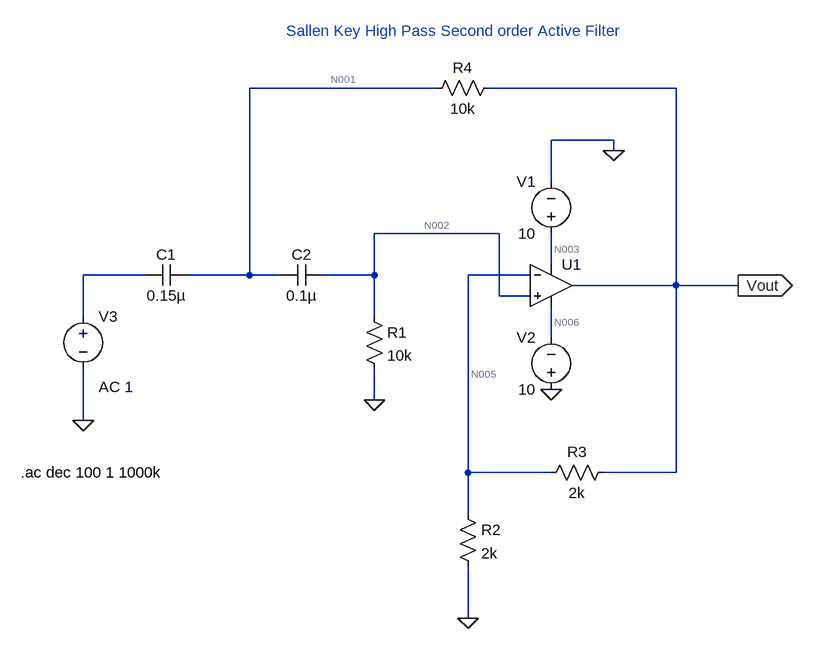
[diagram p0: schematic Second Order High Pass Active Filter.asc]
Second Order High Pass Active Filter.asc, the LTspice schematic file:
Version 4
SHEET 1 880 708
WIRE 96 -128 -192 -128
WIRE 464 -128 176 -128
WIRE 368 -48 272 -48
WIRE 368 -32 368 -48
WIRE 272 16 272 -48
WIRE 192 96 0 96
WIRE 272 144 272 96
WIRE -352 160 -448 160
WIRE -192 160 -192 -128
WIRE -192 160 -288 160
WIRE -144 160 -192 160
WIRE 0 160 0 96
WIRE 0 160 -80 160
WIRE 240 160 144 160
WIRE 464 176 464 -128
WIRE 464 176 304 176
WIRE 560 176 464 176
WIRE 192 192 192 96
WIRE 240 192 192 192
WIRE -448 224 -448 160
WIRE 0 224 0 160
WIRE 272 256 272 208
WIRE 0 352 0 304
WIRE -448 384 -448 304
WIRE 144 464 144 160
WIRE 272 464 144 464
WIRE 464 464 464 176
WIRE 464 464 352 464
WIRE 144 528 144 464
WIRE 144 688 144 608
FLAG 0 352 0
FLAG -448 384 0
FLAG 144 688 0
FLAG 272 336 0
FLAG 368 -32 0
FLAG 560 176 Vout
IOPIN 560 176 Out
SYMBOL Opamps\\UniversalOpamp2 272 176 R0
SYMATTR InstName U1
SYMBOL voltage 272 112 R180
WINDOW 0 24 96 Left 2
WINDOW 3 24 16 Left 2
WINDOW 123 0 0 Left 0
WINDOW 39 0 0 Left 0
SYMATTR InstName V1
SYMATTR Value 10
SYMBOL voltage 272 352 R180
WINDOW 0 24 96 Left 2
WINDOW 3 24 16 Left 2
WINDOW 123 0 0 Left 0
WINDOW 39 0 0 Left 0
SYMATTR InstName V2
SYMATTR Value 10
SYMBOL cap -288 144 R90
WINDOW 0 0 32 VBottom 2
WINDOW 3 32 32 VTop 2
SYMATTR InstName C1
SYMATTR Value 0.15µ
SYMBOL cap -80 144 R90
WINDOW 0 0 32 VBottom 2
WINDOW 3 32 32 VTop 2
SYMATTR InstName C2
SYMATTR Value 0.1µ
SYMBOL res -16 208 R0
SYMATTR InstName R1
SYMATTR Value 10k
SYMBOL res 128 512 R0
SYMATTR InstName R2
SYMATTR Value 2k
SYMBOL res 368 448 R90
WINDOW 0 0 56 VBottom 2
WINDOW 3 32 56 VTop 2
SYMATTR InstName R3
SYMATTR Value 2k
SYMBOL res 192 -144 R90
WINDOW 0 0 56 VBottom 2
WINDOW 3 32 56 VTop 2
SYMATTR InstName R4
SYMATTR Value 10k
SYMBOL voltage -448 208 R0
WINDOW 123 24 124 Left 2
WINDOW 39 0 0 Left 0
SYMATTR Value2 AC 1
SYMATTR InstName V3
SYMATTR Value ""
TEXT -136 -216 Left 2 ;Sallen Key High Pass Second order Active Filter
TEXT -544 464 Left 2 !.ac dec 100 1 1000k

The netlist it stands for:
* Second Order High Pass Active Filter.asc
XU1 N002 N005 N003 N006 Vout level.2 Avol=1Meg GBW=10Meg Slew=10Meg ilimit=25m rail=0 Vos=0 phimargin=45 en=0 enk=0 in=0 ink=0 Rin=500Meg  ; pins IN+ IN- V+ V- OUT
V1 N003 0 10
V2 0 N006 10
C1 N001 N004 0.15µ
C2 N002 N001 0.1µ
R1 N002 0 10k
R2 N005 0 2k
R3 Vout N005 2k
R4 Vout N001 10k
V3 N004 0 AC 1
* Sallen Key High Pass Second order Active Filter
.ac dec 100 1 1000k
.lib UniversalOpamps2.sub
.backanno
.end

* Results of the author's LTspice run, read from the files saved beside the schematic
* Operating Point, zero values left out:
*   V(n003) = 10 V
*   V(n006) = -10 V
*   I(V2) = -999.5 µA
*   I(V1) = -999.5 µA
*   Ix(u1:3) = 999.5 µA
*   Ix(u1:4) = -999.5 µA
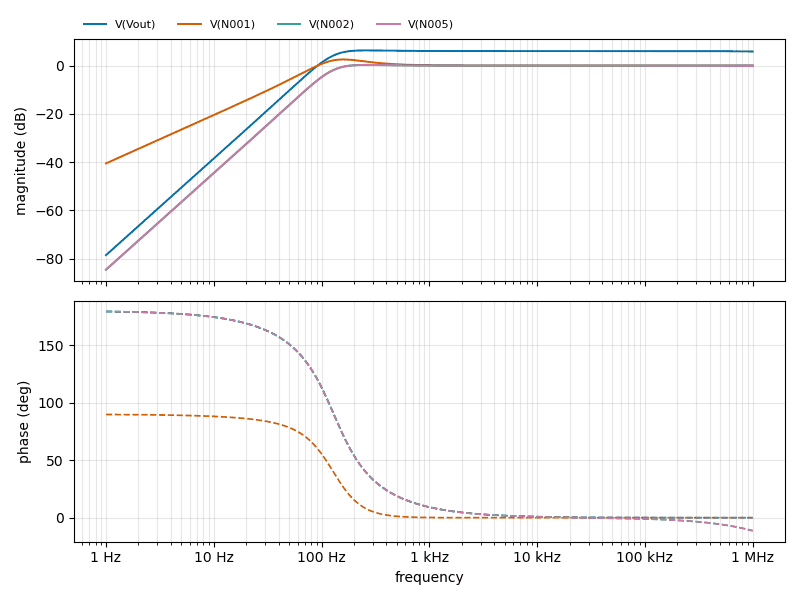
[diagram p1: AC Analysis of Second Order High Pass Active Filter.asc, plotted from the saved traces]
* AC Analysis, 1 run:
*   V(Vout): -78.53 dB at 1 Hz, 5.85 dB at 1 MHz, peak 6.30 dB at 257 Hz, 3 dB below the peak at 117.7 Hz
*   V(N001): -40.51 dB at 1 Hz, -0.00 dB at 1 MHz, peak 2.55 dB at 158.5 Hz, 3 dB below the peak at 87.28 Hz
*   V(N002): -84.55 dB at 1 Hz, -0.00 dB at 1 MHz, peak 0.28 dB at 257 Hz, 3 dB below the peak at 117.7 Hz
*   V(N005): -84.55 dB at 1 Hz, -0.17 dB at 1 MHz, peak 0.28 dB at 257 Hz, 3 dB below the peak at 117.7 Hz